# EAGLE design 328P-AU-RedBit (EAGLE 7.2.0)
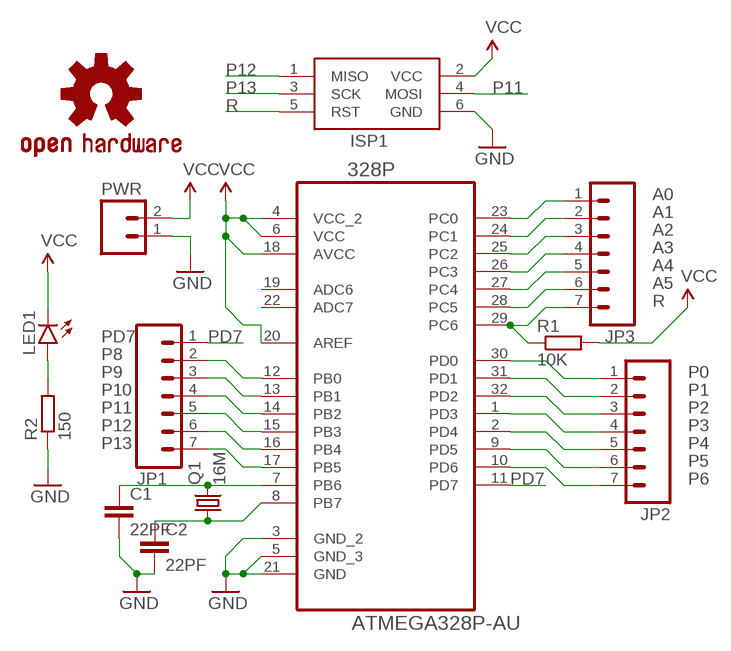
[diagram p0: schematic, sheet 1]

## Parts
328P  ATMEGA328P-AU  [QFP80P900X900X120-32N]
C1  22PF  C-EUC0805  [C0805]
C2  22PF  C-EUC0805  [C0805]
ISP1  AVRISP-6  [AVRISP]
JP1  M07  [1X07]
JP2  M07  [1X07]
JP3  M07  [1X07]
LED1  LED0603  [LED-0603]
LOGO1  OSHW-LOGOS  [OSHW-LOGO-S]
PWR  M02PTH  [1X02]
Q1  16M  CRYSTALHC49S  [HC49/S]
R1  10K  R-EU_R0805  [R0805]
R2  150  R-EU_R0805  [R0805]

## Nets
A0: 328P.23(PC0) JP3.1
A1: 328P.24(PC1) JP3.2
A2: 328P.25(PC2) JP3.3
A3: 328P.26(PC3) JP3.4
A4: 328P.27(PC4) JP3.5
A5: 328P.28(PC5) JP3.6
GND: 328P.3(GND_2) 328P.5(GND_3) 328P.21(GND) C1.2 C2.2 ISP1.6(GND) PWR.1 R2.1
N$1: 328P.7(PB6) C1.1 Q1.2
N$2: 328P.8(PB7) C2.1 Q1.1
N$3: LED1.A R2.2
P0: 328P.30(PD0) JP2.1
P1: 328P.31(PD1) JP2.2
P2: 328P.32(PD2) JP2.3
P3: 328P.1(PD3) JP2.4
P4: 328P.2(PD4) JP2.5
P5: 328P.9(PD5) JP2.6
P6: 328P.10(PD6) JP2.7
P8: 328P.12(PB0) JP1.2
P9: 328P.13(PB1) JP1.3
P10: 328P.14(PB2) JP1.4
P11: 328P.15(PB3) ISP1.4(MOSI) JP1.5
P12: 328P.16(PB4) ISP1.1(MISO) JP1.6
P13: 328P.17(PB5) ISP1.3(SCK) JP1.7
PD7: 328P.11(PD7) JP1.1
R: 328P.29(PC6) ISP1.5(RST) JP3.7 R1.1
VCC: 328P.4(VCC_2) 328P.6(VCC) 328P.18(AVCC) 328P.20(AREF) ISP1.2(VCC) LED1.C PWR.2 R1.2
Unconnected: 328P.19(ADC6) 328P.22(ADC7)

## Library data of the parts
328P = Atmel_By_element14_Batch_1-00:ATMEGA328P-AU: 8-bit Microcontroller with In-System Programmable Flash; MPN: ATMEGA328P-AU; OC_FARNELL: 1715486; OC_NEWARK: 14R4631; PACKAGE: TQFP-32; SUPPLIER: Atmel
C1 C2 = rcl:C-EU: CAPACITOR, European symbol
ISP1 = adafruit:AVRISP: AVR ISP HEADER Standard 6 pin header for AVR programming
JP1-JP3 = SparkFun-Connectors:M07: Header 7 Standard 7-pin 0.1" header. Use with straight break away headers (SKU : PRT-00116), right angle break away headers (PRT-00553), swiss pins (PRT-00743), machine pins (PRT-00117), and female headers (PRT-00115). NOTES ON THE VARIANTS LOCK and LOCK_LONGPADS... This footprint was designed to help hold the alignment of a through-hole component (i.e. 7-pin header) while soldering it into place. You may notice that each hole has been shifted either up or down by 0.005 of an inch from it's more standard position (which is usually a perfectly straight line). This slight alteration caused the pins (the squares in the middle) to touch the edges of the holes. Because they are alternating, it causes a "brace" to hold the header in place. 0.005 has proven to be the perfect amount of "off-center" position when using our standard breakaway headers. Although looks a little odd when you look at the bare footprint, once you have a header in there, the alteration is very hard to notice. Also, if you push a header all the way into place, it is covered up entirely on the bottom side. This idea of altering the position of holes to aid alignment will be further integrated into the Sparkfun Library for other footprints. It can help hold any component with 3 or more connection pins.
LED1 = SparkFun-LED:LED: LEDs Standard schematic elements and footprints for 5mm, 3mm, 1206, and 0603 sized LEDs. 5mm - Spark Fun Electronics SKU : COM-00529 (and others)
LOGO1 = SparkFun-Aesthetics:OSHW-LOGO: Open Source Hardware Logo This logo indicates the piece of hardware it is found on incorporates a OSHW license and/or adheres to the definition of open source hardware found here: http://freedomdefined.org/OSHW
PWR = SparkFun-Connectors:M02: Standard 2-pin 0.1" header. Use with - straight break away headers ( PRT-00116) - right angle break away headers (PRT-00553) - swiss pins (PRT-00743) - machine pins (PRT-00117) - female headers (PRT-00115) Molex polarized connector foot print use with: PRT-08233 with associated crimp pins and housings. 2.54_SCREWTERM for use with PRT-10571. 3.5mm Screw Terminal footprints for PRT-08084 5mm Screw Terminal footprints for use with PRT-08432
Q1 = adafruit:CRYSTAL: CRYSTAL; OC_FARNELL: 1667008; OC_NEWARK: unknown
R1 R2 = rcl:R-EU_: RESISTOR, European symbol

## Board
micro duino Rev 1- Basically just a real tiny arduino duemilanove
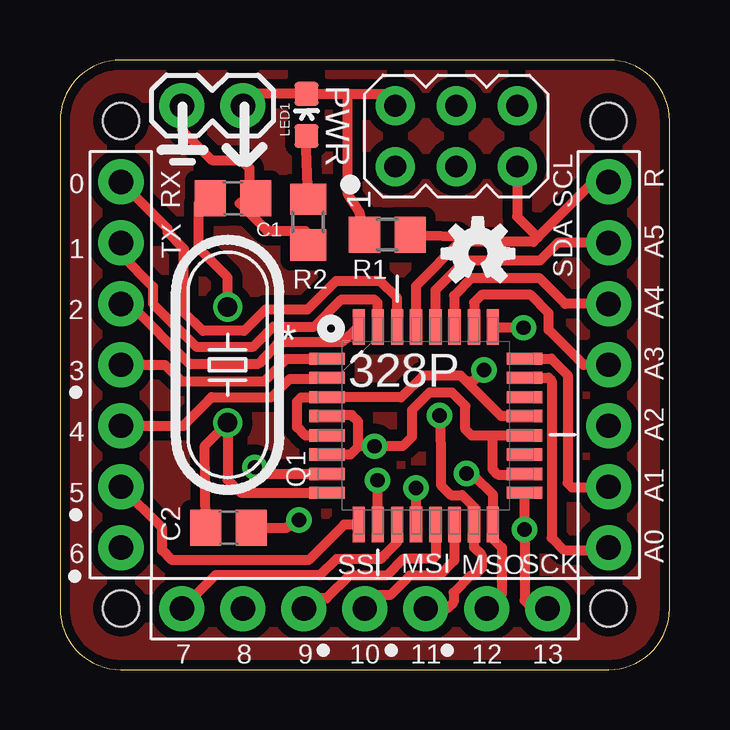
[diagram p1: board, top side]
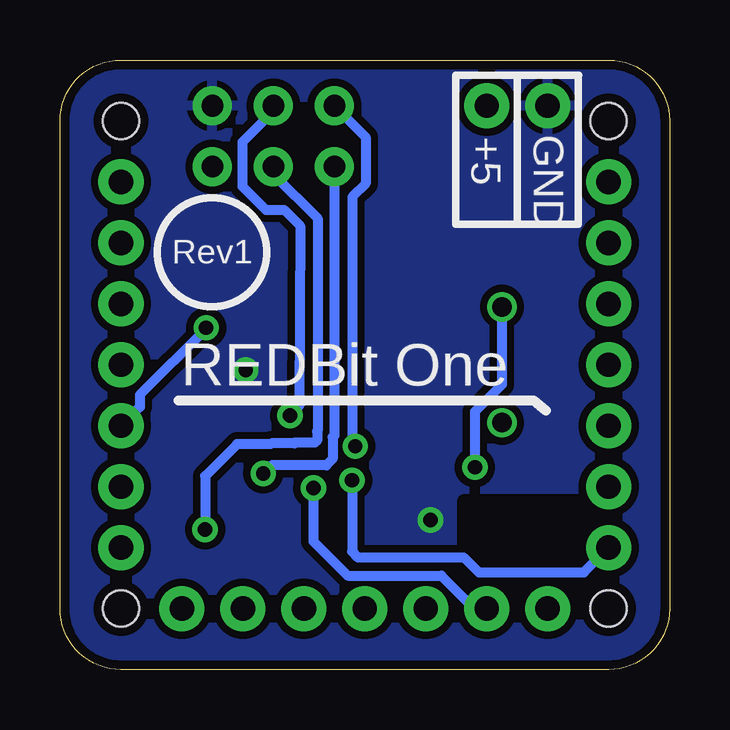
[diagram p2: board, bottom side, seen from below]

Size 25.4 x 25.4 mm. Coordinates in mm from the lower left corner, seen from the top.
Outline: 0,22.86 0,2.54 arc90 2.54,0 22.86,0 arc90 25.4,2.54 25.4,22.86 arc90 22.86,25.4 2.54,25.4 arc90 0,22.86
Copper layers (1*16): Top 0.0356mm / dielectric 1.5011mm / Bottom 0.0356mm
Design rules "LaenPCBOrder *": minimum track width 6mil, minimum drill 13mil, track to track 6mil, track to pad 6mil, pad to pad 6mil, via to via 6mil, smd to smd 6mil, copper to edge 15mil, drill to drill 6mil, minimum pad ring 7mil, minimum via ring 9mil, stop-mask expansion 3mil, vias tented up to drill 240mil, thermal gap 10mil
Holes 1.5 mm at 22.86,2.54 2.54,22.86 22.86,22.86 2.54,2.54
bRestrict: area 3.9,5.5 to 8.6,7

### Footprints (pad centres in the part's own frame; a part is rotated, then mirrored left to right if it is on the bottom)
QFP80P900X900X120-32N = smd 1.473 x 0.508: 1 -4.115,2.794; 2 -4.115,2.007; 3 -4.115,1.194; 4 -4.115,0.406; 5 -4.115,-0.406; 6 -4.115,-1.194; 7 -4.115,-2.007; 8 -4.115,-2.794; 17 4.115,-2.794; 18 4.115,-2.007; 19 4.115,-1.194; 20 4.115,-0.406; 21 4.115,0.406; 22 4.115,1.194; 23 4.115,2.007; 24 4.115,2.794 | smd 0.508 x 1.473: 9 -2.794,-4.115; 10 -2.007,-4.115; 11 -1.194,-4.115; 12 -0.406,-4.115; 13 0.406,-4.115; 14 1.194,-4.115; 15 2.007,-4.115; 16 2.794,-4.115; 25 2.794,4.115; 26 2.007,4.115; 27 1.194,4.115; 28 0.406,4.115; 29 -0.406,4.115; 30 -1.194,4.115; 31 -2.007,4.115; 32 -2.794,4.115
C0805 = smd 1.3 x 1.5: 1 -0.95,0; 2 0.95,0
AVRISP = drill 0.9 pad 1.626: 1 -1.27,2.54; 2 1.27,2.54; 3 -1.27,0; 4 1.27,0; 5 -1.27,-2.54; 6 1.27,-2.54
1X07 = drill 1.016 pad 1.88: 1 0,0; 2 2.54,0; 3 5.08,0; 4 7.62,0; 5 10.16,0; 6 12.7,0; 7 15.24,0
LED-0603 = smd 1 x 1: A 0,-0.877; C 0,0.877
1X02 = drill 1.016 pad 1.88: 1 0,0; 2 2.54,0
HC49/S = drill 0.813: 1 -2.413,0; 2 2.413,0
R0805 = smd 1.3 x 1.5: 1 -0.95,0; 2 0.95,0

### Placement (x,y rotation side)
328P  15.24,10.16 0 top
C1  7.21,19.64 0 top
C2  7.02,5.91 0 top
ISP1  16.51,22.23 90 top
JP1  5.08,2.54 0 top
JP2  2.54,20.32 270 top
JP3  22.86,5.08 90 top
LED1  10.27,23.11 0 top
LOGO1  17.41,17.34 0 top
PWR  5.08,23.5 0 top
Q1  6.99,12.7 90 top
R1  13.64,18.13 180 top
R2  10.34,18.65 90 top

### Tracks (layer width: path | path; a pad name or v marks a point on that pad's centre or on a via)
A0
  Top 0.406: 328P.23 20.35,12.17 20.49,12.03 20.49,5.49 21,4.98 22.76,4.98 JP3.1
A1
  Top 0.406: 328P.24 20.47,12.95 21.05,12.38 | 21.05,12.38 | 21.05,12.38 21.16,12.27 21.16,7.77 21.33,7.6 22.84,7.6 JP3.2
A2  (via drill 0.6)
  Top 0.406: 328P.25 19.28,14.28 v19.31,14.24
  Bottom 0.406: v19.31,14.24 19.31,14.21 22.07,11.45 22.07,10.95 JP3.3
A3
  Top 0.406: JP3.4 21.82,12.7 20.36,14.15 20.36,14.86 19.61,15.61 17.57,15.61 17.25,15.3 328P.26
A4
  Top 0.406: JP3.5 21.05,15.24 19.99,16.3 17.14,16.3 16.43,15.58 16.43,14.28 328P.27
A5
  Top 0.406: JP3.6 20.74,17.78 19.99,17.04 16.87,17.04 15.64,15.81 328P.28
GND  (via drill 0.6)
  Top 0.254: 10.22,9.75 10.22,9.77 9.86,10.13 9.86,11.13 9.92,11.19 10.01,11.19 10.18,11.37 14.19,11.37 14.22,11.4 14.3,11.4 15.13,12.22 16.57,12.22 16.6,12.25 16.72,12.25 16.95,12.02
  Top 0.406: PWR.1 5.08,22.48 6.33,21.23 7.55,21.23 7.89,20.9 7.89,19.73 C1.2 7.48,19.43 8.63,18.28 10.22,18.28 R2.1 | 328P.5 10.22,9.75 9.88,10.09 9.88,11.18 10.05,11.35 11.12,11.35 328P.3 14.22,11.34 15.13,12.25 16.6,12.25 16.69,12.25 18.38,10.57 328P.21 | C2.2 9.4,5.91 v9.96,6.24 | 16.95,12.02 17.19,12.02 v17.66,12.49
  Bottom 0.406: v9.96,6.24 9.96,6.29 | v17.66,12.49 17.66,12.55 17.69,12.58
  pour Bottom (isolate 0.305): 22.86,0 2.54,0 arc-90 0,2.54 0,22.86 arc-90 2.54,25.4 22.86,25.4 arc-90 25.4,22.86 25.4,2.54 arc-90
N$1  (via drill 0.6)
  Top 0.406: Q1.2 6.99,16.35 5.77,17.56 5.77,19.42 C1.1 | v8.11,8.43 8.21,8.43 8.48,8.16 328P.7
  Bottom 0.406: Q1.2 6.99,11.88 8.11,10.75 v8.11,8.43
N$2
  Top 0.406: C2.1 6.04,9.34 Q1.1 6.99,7.91 7.52,7.37 11.12,7.37 328P.8
N$3
  Top 0.406: R2.2 10.23,22.2 LED1.A
N$4
  pour Top (isolate 0.406, no thermals): 22.86,0 2.54,0 arc-90 0,2.54 0,22.86 arc-90 2.54,25.4 22.86,25.4 arc-90 25.4,22.86 25.4,2.54 arc-90
P0
  Top 0.406: 328P.30 14.05,15.49 13.35,16.19 11.5,16.19 10.31,15 8.56,15 7.67,14.11 5.95,14.11 5.17,14.9 5.17,17.53 4.48,18.22 4.48,18.38 JP2.1
P1
  Top 0.406: JP2.2 2.54,17.3 3.88,15.96 3.88,15.25 5.67,13.45 8.05,13.45 8.89,14.29 10.59,14.29 11.73,15.43 13.09,15.43 13.22,15.3 13.22,14.29 328P.31
P2
  Top 0.406: JP2.3 2.9,15.24 5.39,12.74 8.28,12.74 9.14,13.67 11.78,13.67 328P.32
P3
  Top 0.406: JP2.4 4.37,12.7 5.07,12.01 8.51,12.01 9.45,12.95 11.12,12.95 328P.1
P4
  Top 0.406: JP2.5 5.14,10.16 6.21,11.22 6.21,11.25 6.31,11.35 8.81,11.35 9.57,12.11 11.07,12.11 328P.2
P5
  Top 0.406: 328P.9 11.84,6.04 10.36,4.56 4.66,4.56 4.25,4.97 4.25,5.91 JP2.6
P6  (via drill 0.6)
  Top 0.406: 328P.10 13.23,7.39 v13.23,7.89
  Bottom 0.406: v13.23,7.89 13.23,4.92 12.98,4.68 8.58,4.68 7.95,4.05 3.57,4.05 JP2.7
P8  (via drill 0.6)
  Top 0.406: 328P.12 v14.83,7.56 v14.84,7.57
  Bottom 0.406: v14.84,7.57 14.84,5.34 13.42,3.92 9.51,3.92 8.45,2.85 7.93,2.85 JP1.2
P9
  Top 0.406: 328P.13 15.65,4.72 15.54,4.62 14.31,4.62 13.61,3.91 12.04,3.91 11.1,2.97 10.59,2.97 JP1.3
P10
  Top 0.406: 328P.14 16.43,4.71 16.43,4.56 16.42,4.53 15.81,3.91 14.57,3.91 13.75,3.1 13.26,3.1 JP1.4
P11  (via drill 0.6)
  Top 0.406: JP1.5 15.27,2.57 16.16,2.57 16.4,2.81 16.4,3.21 17.12,3.93 17.28,3.93 17.57,4.22 17.57,4.78 17.25,5.1 328P.15 17.27,6.07 17.27,6.75 16.75,7.27 16.29,7.27 15.87,7.69 15.87,8.55 15.84,10.41 v15.81,10.59
  Bottom 0.406: ISP1.4 16.51,23.26 17.75,22.02 | 17.75,22.02 | 17.75,22.02 17.8,21.98 17.8,20.13 16.82,19.15 16.07,19.15 15.4,18.49 15.43,11.02 v15.81,10.59
P12  (via drill 0.6)
  Top 0.406: JP1.6 18.41,3.17 18.41,5.08 18.03,5.46 328P.16 18.02,7.31 17.27,8.07 v16.93,8.18
  Bottom 0.406: ISP1.1 13.97,9.76 14.04,9.69 14.04,8.78 14.3,8.51 16.6,8.51 v16.93,8.18
P13  (via drill 0.6)
  Top 0.406: JP1.7 20.32,1.91 19.36,2.87 v19.36,5.84 328P.17
  Bottom 0.406: ISP1.3 16.51,20.64 14.67,18.8 14.67,9.95 14.69,9.93 14.69,9.54 14.78,9.45 15.6,9.45 15.63,9.43 16.6,9.43 16.62,9.4 18.02,9.4 19.36,8.07 v19.36,5.84 | v19.36,5.84
PD7
  Top 0.406: 328P.11 14.05,5.3 13.53,4.79 13.53,4.78 13.36,4.61 11.51,4.61 10.83,3.93 6.47,3.93 JP1.1
R
  Top 0.406: 328P.29 14.83,15.99 16.72,17.88 | 19.91,18.01 22.22,20.32 JP3.7 23.09,20.32 | 19.91,18.01 19.72,17.82 16.79,17.82 16.72,17.88 | ISP1.5 19.05,18.88 19.91,18.01 | R1.1 16.55,18.05 16.72,17.88
VCC  (via drill 0.6)
  Top 0.406: 328P.6 12.11,8.97 12.42,9.28 12.42,9.45 | 12.42,9.45 12.42,10.34 12.16,10.6 11.16,10.6 328P.4 | 12.42,9.45 12.57,9.31 v13.1,9.31 14.28,9.31 14.66,9.69 14.66,10.81 15.39,11.54 16.34,11.54 16.89,10.99 16.89,10.01 17.16,9.75 328P.20 18.02,9.75 18.01,9.75 18.01,8.36 18.25,8.13 19.33,8.13 328P.18 | 12.13,23.99 LED1.C 8.11,23.99 PWR.2 | 12.13,23.99 13.48,23.99 ISP1.2 | R1.2 12.49,19.04 11.99,19.8 11.99,23.85 12.13,23.99
  Bottom 0.406: v13.1,9.31 13.22,9.43 13.22,19.69 12.66,20.25 12.66,22.19 ISP1.2

### Text on the board
tPlace: RX | SCL | 0 | R | TX | SDA | 1 | A5 | 2 | A4 | 3 | A3 | 4 | A2 | 5 | A1 | SCK | 6 | SS | MSI | MSO | A0 | 7 | 8 | 9 | 10 | 11 | 12 | 13
bPlace: GND | +5 | Rev1 | REDBit One